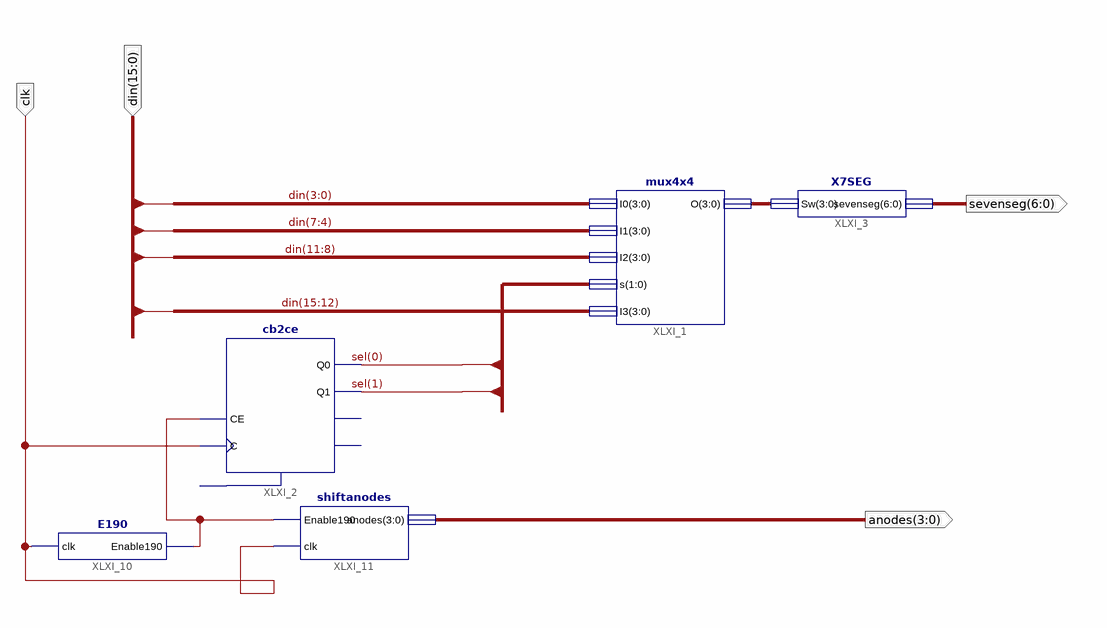
[diagram p0: schematic sheet 1]
// Xilinx ISE schematic afficheur.sch (spartan6) as structural Verilog: 5 symbols, 4 ports
module afficheur (
  input  [15:0] din,
  input  clk,
  output [6:0] sevenseg,
  output [3:0] anodes
);

  wire XLXN_17;
  wire [1:0] sel;
  wire [3:0] XLXN_14;

  mux4x4 XLXI_1 (.I0(din[3:0]), .I1(din[7:4]), .I2(din[11:8]), .s(sel), .I3(din[15:12]), .O(XLXN_14));
  cb2ce XLXI_2 (.C(clk), .CE(XLXN_17), .Q0(sel[0]), .Q1(sel[1]));  // open: CLR, CEO, TC
  X7SEG XLXI_3 (.Sw(XLXN_14), .sevenseg(sevenseg));
  E190 XLXI_10 (.clk(clk), .Enable190(XLXN_17));
  shiftanodes XLXI_11 (.Enable190(XLXN_17), .clk(clk), .anodes(anodes));
endmodule
